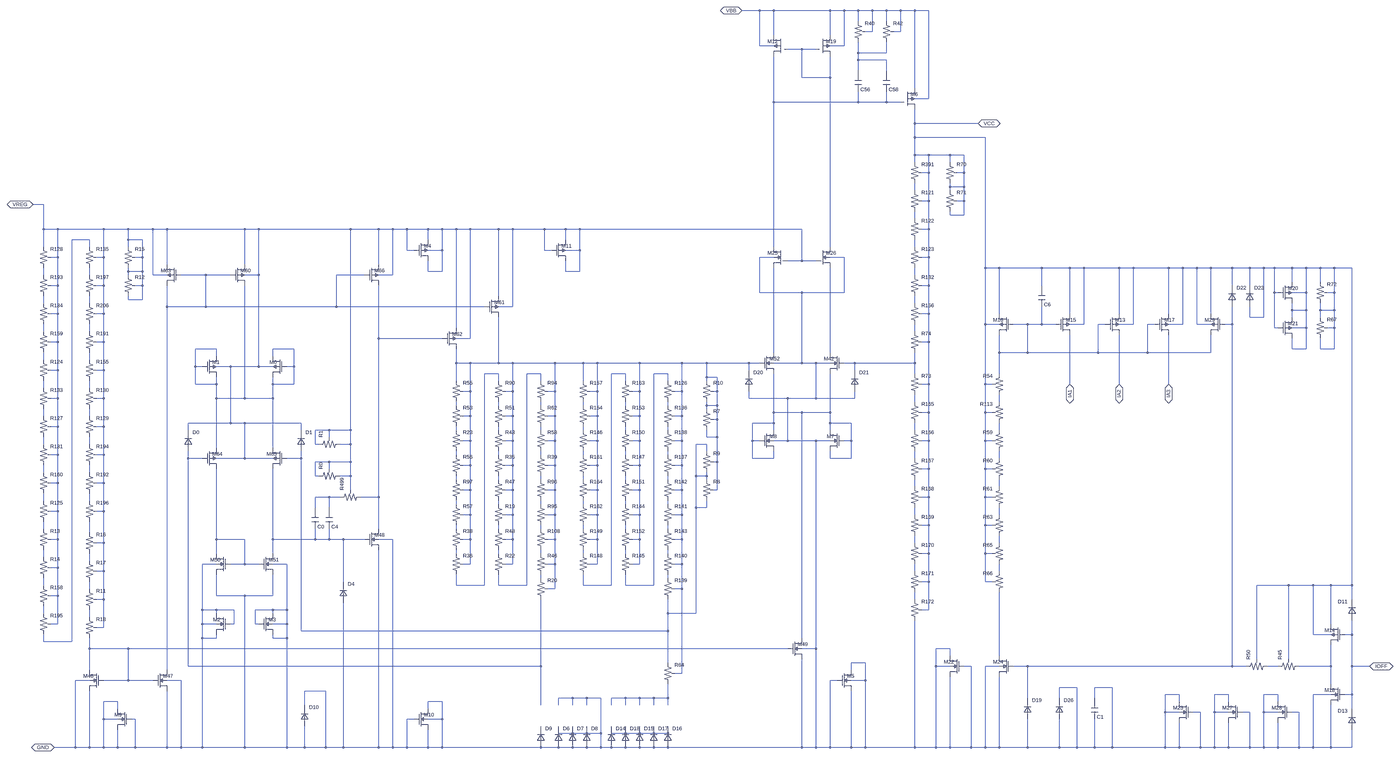
[diagram p0: schematic &400_VREG_00.asc, whole sheet]
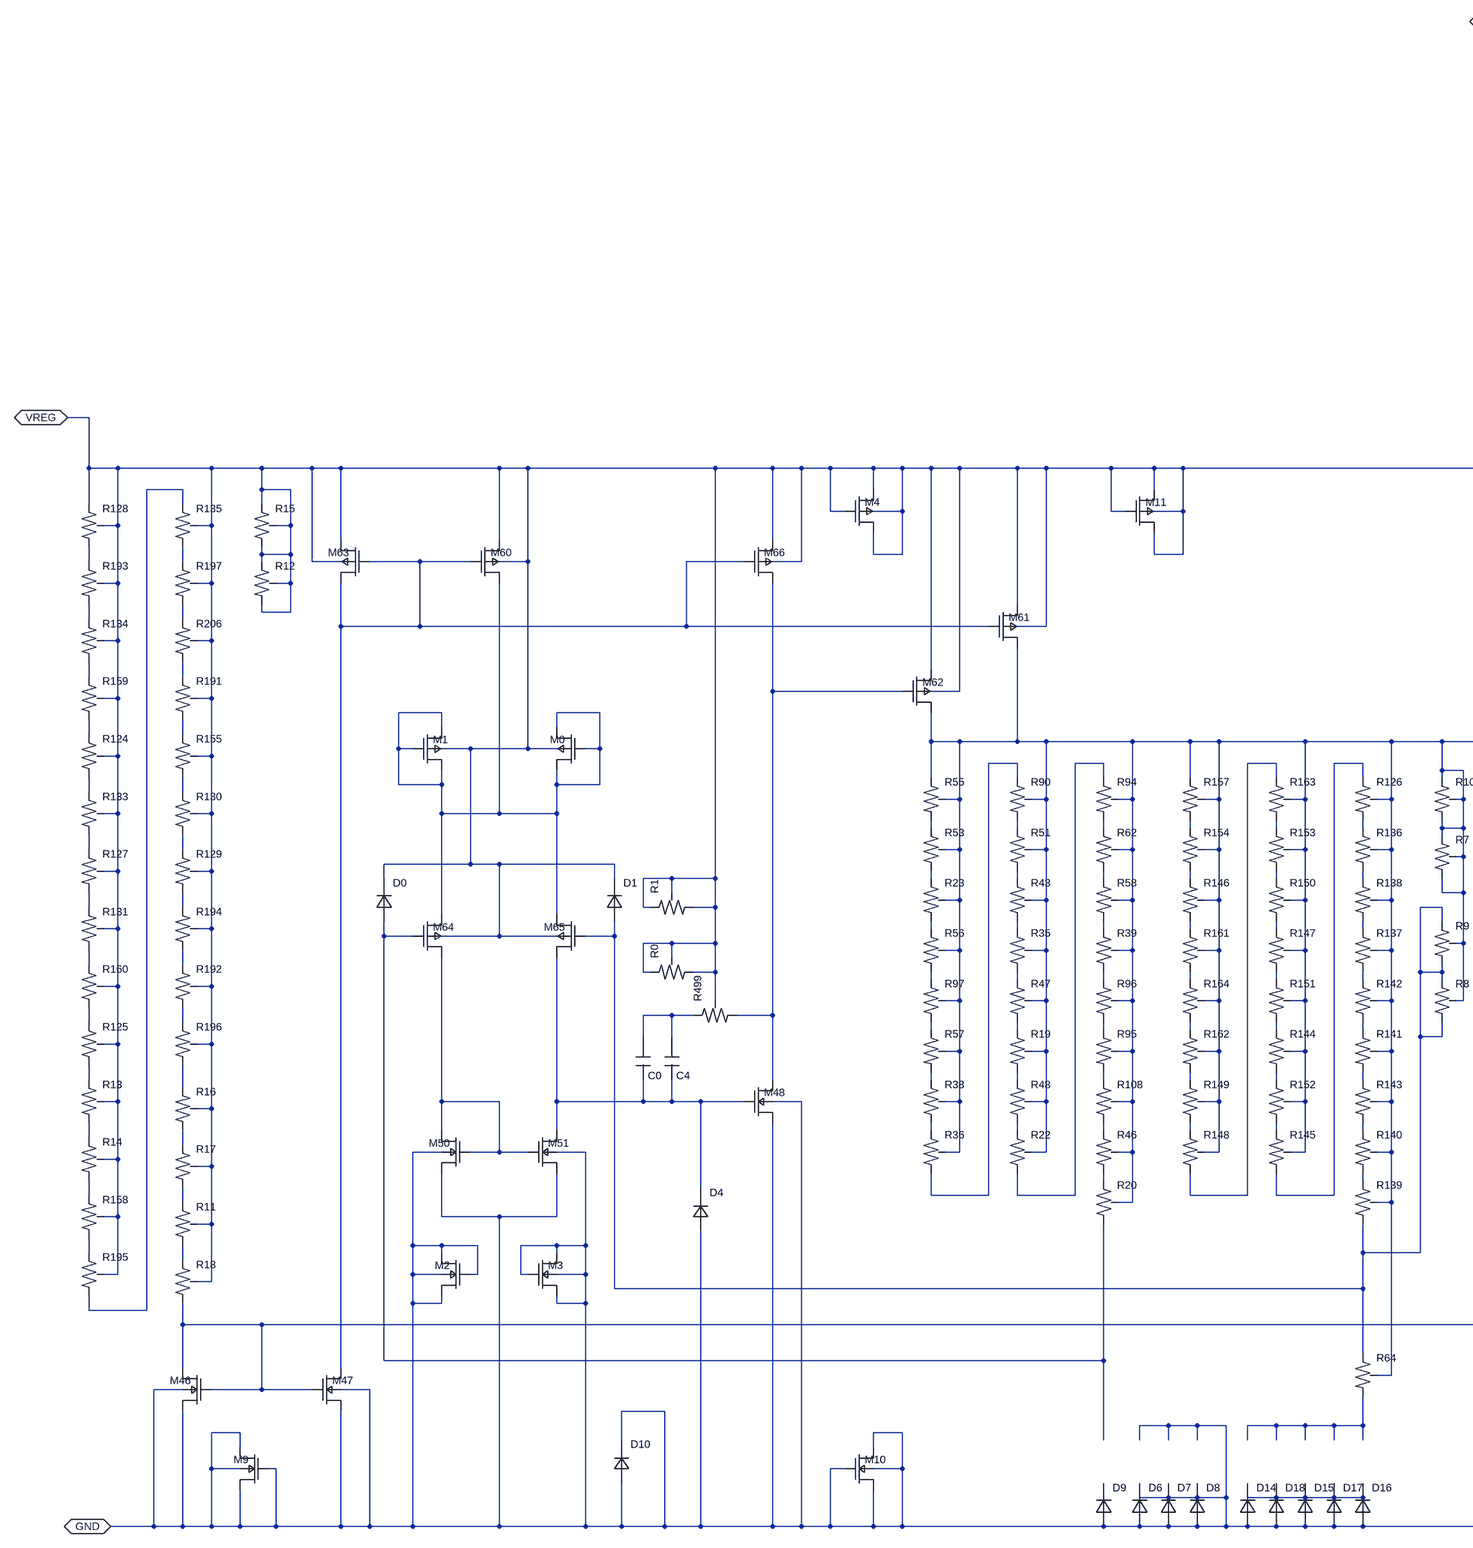
[diagram p1: schematic &400_VREG_00.asc, part, row 1 of 1, column 1 of 2]
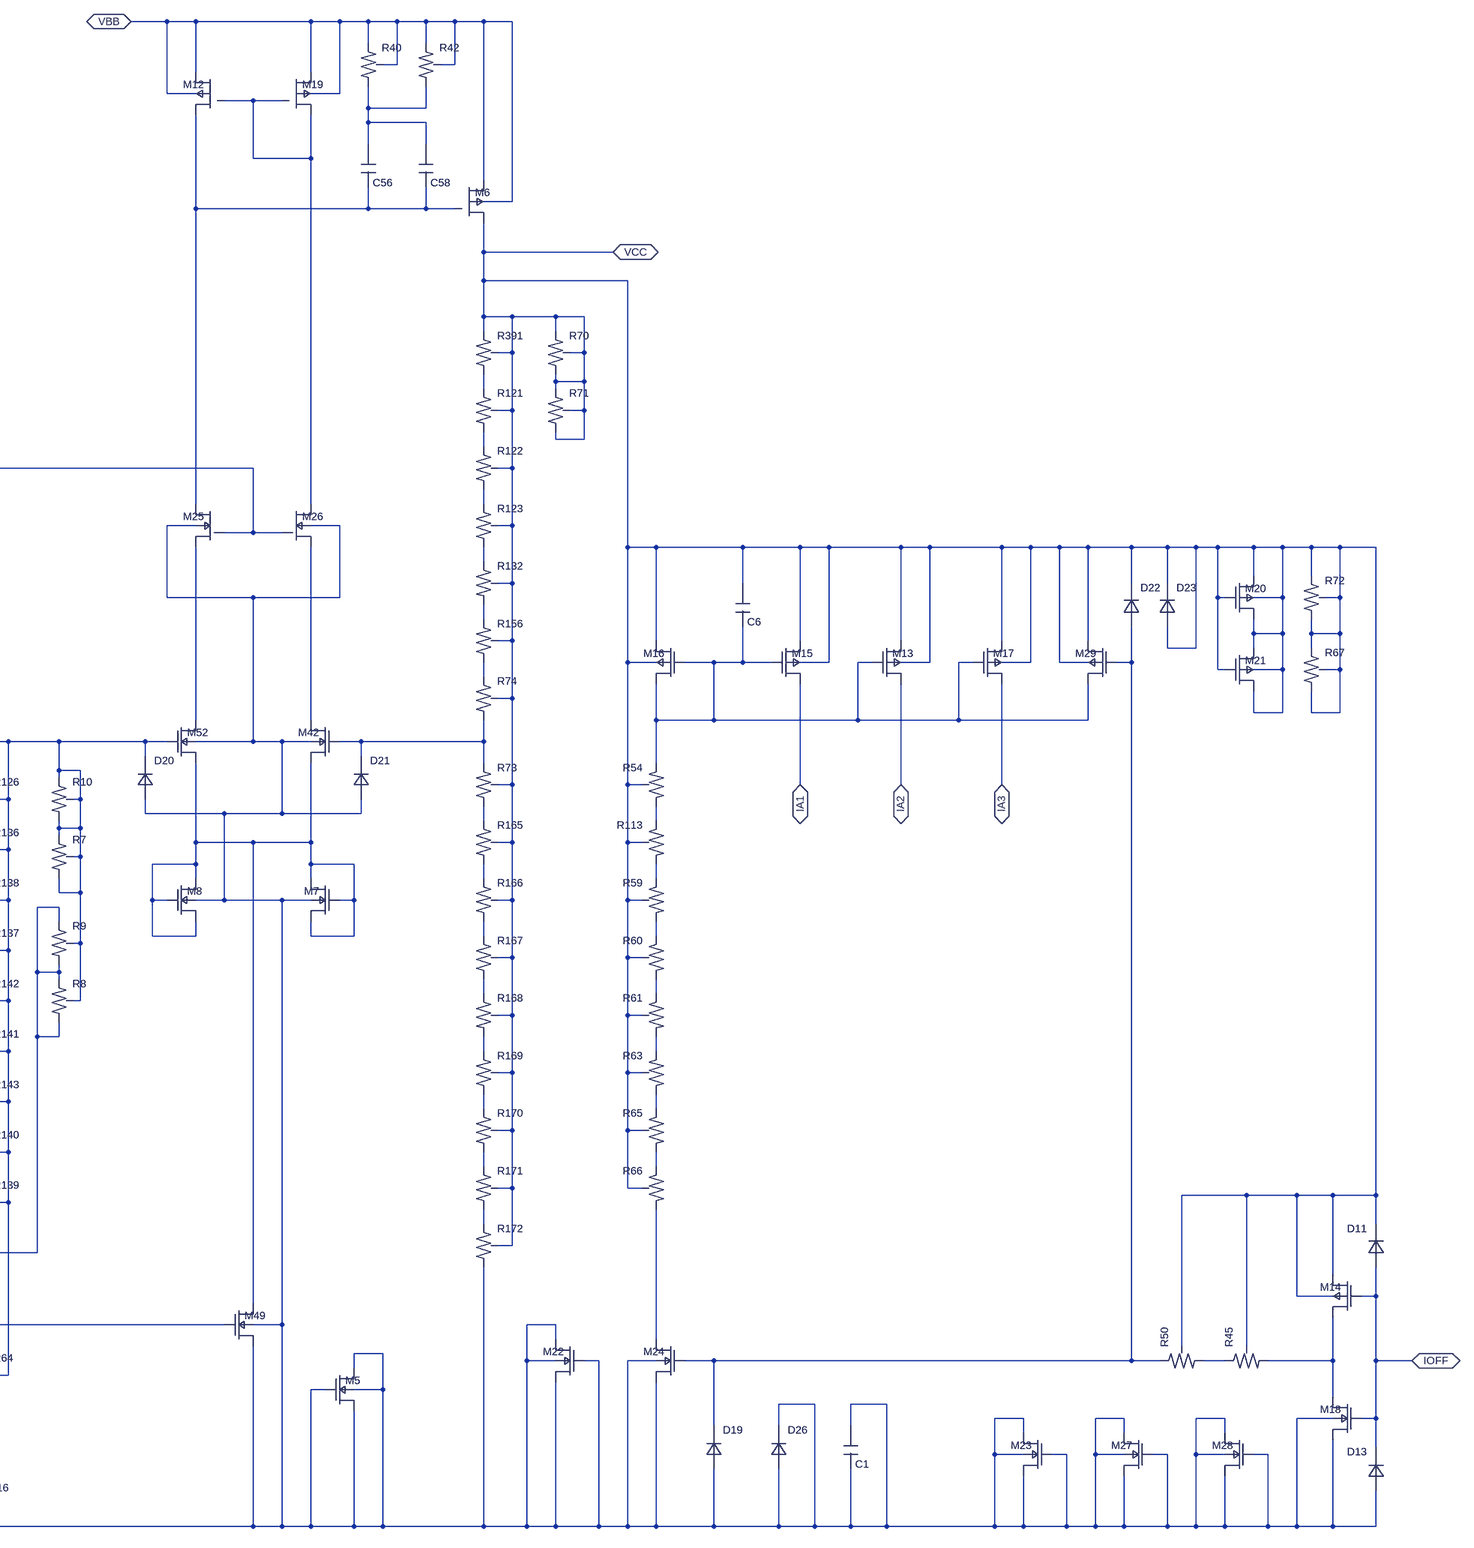
[diagram p2: schematic &400_VREG_00.asc, part, row 1 of 1, column 2 of 2]
&400_VREG_00.asc, the LTspice schematic file:
Version 4
SHEET 1 7088 2000
WIRE 3664 -704 3664 -928
WIRE 1008 -496 1008 -512
WIRE 2384 -2400 2448 -2400
WIRE 1872 -2400 2128 -2400
WIRE 2192 -2240 2192 -2400
WIRE 1808 -2240 1808 -2400
WIRE 2128 -2240 2192 -2240
WIRE 1808 -2240 1872 -2240
WIRE 1808 -2400 1872 -2400
WIRE 2256 -2352 2256 -2400
WIRE 2288 -2304 2320 -2304
WIRE 2384 -2352 2384 -2400
WIRE 1728 -2400 1808 -2400
WIRE 2576 -2000 2576 -2400
WIRE 2512 -2000 2576 -2000
WIRE 2416 -2304 2448 -2304
WIRE 2128 -2288 2128 -2400
WIRE 2448 -2400 2512 -2400
WIRE 1872 -2288 1872 -2400
WIRE 2128 -2400 2192 -2400
WIRE 2512 -2048 2512 -2400
WIRE 2256 -2400 2320 -2400
WIRE 2320 -2304 2320 -2400
WIRE 2512 -2400 2576 -2400
WIRE 2448 -2304 2448 -2400
WIRE 2320 -2400 2384 -2400
WIRE 2192 -2400 2256 -2400
WIRE 4496 704 4496 576
WIRE 4496 768 4496 704
WIRE 4496 432 4496 368
WIRE 4496 432 4464 432
WIRE 4496 704 4464 704
WIRE 4496 576 4496 432
WIRE 4496 576 4576 576
WIRE -1440 -560 -1440 -592
WIRE -1440 -48 -1440 -80
WIRE 1200 -48 1200 -64
WIRE 2512 -368 2512 -400
WIRE 432 -496 432 -512
WIRE 2896 -112 2896 -144
WIRE 1872 -576 2000 -576
WIRE 2224 -448 2224 -528
WIRE 2128 -528 2224 -528
WIRE 2224 -368 2224 -448
WIRE 1776 -448 1808 -448
WIRE 2128 -368 2224 -368
WIRE 1776 -528 1872 -528
WIRE 2128 -528 2128 -576
WIRE 1872 -528 1872 -576
WIRE 2192 -448 2224 -448
WIRE 2128 -368 2128 -400
WIRE 1872 -368 1872 -400
WIRE 1776 -448 1776 -528
WIRE 1872 -496 1872 -528
WIRE 2128 -496 2128 -528
WIRE 1872 -576 1872 -752
WIRE 2000 -576 2128 -576
WIRE 2128 -576 2128 -752
WIRE 1776 -368 1872 -368
WIRE 1776 -368 1776 -448
WIRE 2000 448 2000 -576
WIRE 624 -160 624 -176
WIRE 1392 64 1392 48
WIRE -1232 -304 -1232 -336
WIRE -144 -144 -144 -192
WIRE -144 -192 -96 -192
WIRE -208 -144 -208 -192
WIRE -208 -192 -144 -192
WIRE -1232 -176 -1232 -208
WIRE 1392 -608 1392 -624
WIRE 1200 -496 1200 -512
WIRE 816 64 816 48
WIRE 3568 -848 3568 -976
WIRE 2896 -848 3024 -848
WIRE 3024 -848 3024 -976
WIRE 3088 -976 3088 -1056
WIRE 3024 -848 3344 -848
WIRE 3344 -848 3568 -848
WIRE 3344 -976 3376 -976
WIRE 2896 -848 2896 -928
WIRE 2960 -976 3024 -976
WIRE 3568 -976 3600 -976
WIRE 2896 -752 2896 -848
WIRE 3568 -848 3856 -848
WIRE 3856 -848 3856 -928
WIRE 3088 -976 3152 -976
WIRE 3344 -848 3344 -976
WIRE 3024 -976 3088 -976
WIRE 2384 -1984 2384 -2032
WIRE 1872 -1984 1872 -2192
WIRE 2256 -1984 2256 -2032
WIRE 1872 -1328 1872 -1984
WIRE 2384 -1984 2448 -1984
WIRE 1872 -1984 2256 -1984
WIRE 2256 -1984 2384 -1984
WIRE -1440 -432 -1440 -464
WIRE 1200 -160 1200 -176
WIRE -1440 -1200 -1440 -1232
WIRE -1232 352 -1232 320
WIRE 1872 -848 1872 -1232
WIRE 2128 -848 2128 -1232
WIRE 4400 576 4400 480
WIRE 4256 576 4400 576
WIRE 4400 656 4400 576
WIRE 432 64 432 48
WIRE 2512 144 2512 112
WIRE 1392 -160 1392 -176
WIRE 2512 -1328 2512 -1360
WIRE -1232 -944 -1232 -976
WIRE -1440 -1072 -1440 -1104
WIRE 624 -496 624 -512
WIRE 1200 -272 1200 -288
WIRE -1056 640 -1056 496
WIRE -1168 640 -1056 640
WIRE -1056 640 -944 640
WIRE -1232 496 -1056 496
WIRE -1232 592 -1232 496
WIRE -1232 496 -1232 448
WIRE -1056 496 1936 496
WIRE 2512 -624 2512 -656
WIRE 2512 -1072 2512 -1104
WIRE -1232 224 -1232 192
WIRE 2512 -1200 2512 -1232
WIRE -1440 -176 -1440 -208
WIRE -784 -368 -784 -400
WIRE -784 -368 -720 -368
WIRE -784 576 -784 -368
WIRE 816 752 816 576
WIRE -784 576 816 576
WIRE 816 576 816 272
WIRE -144 0 -80 0
WIRE -144 0 -144 -48
WIRE -400 64 -400 0
WIRE -80 192 -80 0
WIRE -208 0 -208 -48
WIRE -208 0 -144 0
WIRE -400 0 -208 0
WIRE -80 0 16 0
WIRE -400 0 -400 -320
WIRE 1392 -272 1392 -288
WIRE 2512 16 2512 -16
WIRE -1232 -432 -1232 -464
WIRE 432 -608 432 -624
WIRE 1008 64 1008 48
WIRE 624 -384 624 -400
WIRE 816 -272 816 -288
WIRE 1008 -384 1008 -400
WIRE -1232 -560 -1232 -592
WIRE 624 -272 624 -288
WIRE 432 208 432 160
WIRE 432 208 560 208
WIRE 560 -752 624 -752
WIRE 624 -720 624 -752
WIRE 560 208 560 -752
WIRE 816 -496 816 -512
WIRE -1312 464 -1312 -1360
WIRE -1232 -1328 -1232 -1360
WIRE -1312 -1360 -1232 -1360
WIRE -1440 464 -1312 464
WIRE -1440 464 -1440 432
WIRE 1392 176 1392 160
WIRE 3216 -704 3216 -928
WIRE 3440 -704 3440 -928
WIRE 2512 -1824 2832 -1824
WIRE 2512 -1888 2512 -1952
WIRE 2576 -1280 2576 -1408
WIRE 2672 -1600 2736 -1600
WIRE 2544 -576 2576 -576
WIRE 2576 -64 2576 -192
WIRE 2544 320 2576 320
WIRE 2576 320 2576 192
WIRE 2576 -320 2576 -448
WIRE 2544 64 2576 64
WIRE 3728 -976 3728 -1232
WIRE 4416 -1232 4496 -1232
WIRE 2576 -192 2576 -320
WIRE 2576 192 2576 64
WIRE 2544 -1408 2576 -1408
WIRE 2544 -1664 2576 -1664
WIRE 2896 -1024 2896 -1232
WIRE 2544 192 2576 192
WIRE 2512 -1888 2800 -1888
WIRE 2672 -1712 2672 -1744
WIRE 2512 -1824 2512 -1888
WIRE 2544 -448 2576 -448
WIRE 2704 -1536 2736 -1536
WIRE 4224 -960 4288 -960
WIRE 4224 -864 4224 -912
WIRE 2512 -1712 2512 -1744
WIRE 2576 -1024 2576 -1152
WIRE 4224 -1232 4288 -1232
WIRE 3088 -1232 3216 -1232
WIRE 2672 -1472 2736 -1472
WIRE 2672 -1584 2672 -1600
WIRE 2736 -1472 2736 -1536
WIRE 2512 -1744 2512 -1824
WIRE 2544 -1152 2576 -1152
WIRE 2544 -1280 2576 -1280
WIRE 2672 -1744 2736 -1744
WIRE 2576 -1408 2576 -1536
WIRE 2736 -1664 2736 -1744
WIRE 2544 -64 2576 -64
WIRE 2576 -448 2576 -576
WIRE 2544 -192 2576 -192
WIRE 2544 -320 2576 -320
WIRE 2576 64 2576 -64
WIRE 2544 -1024 2576 -1024
WIRE 2544 -1536 2576 -1536
WIRE 2576 -1536 2576 -1664
WIRE 4352 -1040 4352 -1072
WIRE 2576 -1152 2576 -1280
WIRE 2576 -1664 2576 -1744
WIRE 2832 -976 2896 -976
WIRE 4400 384 4400 208
WIRE 4400 208 4496 208
WIRE 3280 -1232 3440 -1232
WIRE 4320 432 4400 432
WIRE 4496 272 4496 208
WIRE 2512 -1744 2576 -1744
WIRE 4496 208 4496 -1232
WIRE 4288 -1120 4288 -1232
WIRE 4032 -1008 4096 -1008
WIRE 4320 432 4320 208
WIRE 3728 -1232 3792 -1232
WIRE 2832 -976 2832 -1232
WIRE 3216 -1024 3216 -1232
WIRE 4096 -1008 4096 -1232
WIRE 4320 208 4400 208
WIRE 3216 -1232 3280 -1232
WIRE 3216 -976 3280 -976
WIRE 3664 -976 3728 -976
WIRE 3792 -976 3792 -1232
WIRE 3280 -976 3280 -1232
WIRE 3952 -1152 3952 -1232
WIRE 3792 -1232 3856 -1232
WIRE 4224 -1120 4288 -1120
WIRE 2896 -1232 3088 -1232
WIRE 3664 -1024 3664 -1232
WIRE 3792 -976 3856 -976
WIRE 4288 -864 4288 -960
WIRE 3440 -976 3504 -976
WIRE 2832 -704 2832 -976
WIRE 2832 -1232 2896 -1232
WIRE 2544 -704 2576 -704
WIRE 2832 -576 2864 -576
WIRE 2832 -576 2832 -704
WIRE 2832 -448 2864 -448
WIRE 2832 -320 2864 -320
WIRE 3664 -1232 3728 -1232
WIRE 2832 -704 2864 -704
WIRE 2832 -448 2832 -576
WIRE 2832 -320 2832 -448
WIRE 2832 192 2832 64
WIRE 2832 64 2832 -64
WIRE 4064 544 4064 208
WIRE 2832 192 2864 192
WIRE 4064 208 4208 208
WIRE 2832 -64 2864 -64
WIRE 2736 -1536 2736 -1600
WIRE 2832 64 2864 64
WIRE 2576 -704 2576 -896
WIRE 3952 -1232 4032 -1232
WIRE 4208 544 4208 208
WIRE 2832 -1232 2832 -1824
WIRE 2832 -192 2832 -320
WIRE 4208 208 4320 208
WIRE 2832 -192 2864 -192
WIRE 2832 -64 2832 -192
WIRE 3856 -1024 3856 -1232
WIRE 4144 -960 4144 -1120
WIRE 4288 -960 4288 -1040
WIRE 2672 -1472 2672 -1488
WIRE 2736 -1600 2736 -1664
WIRE 2672 -1600 2672 -1616
WIRE 2704 -1664 2736 -1664
WIRE 4144 -960 4160 -960
WIRE 4416 -1120 4416 -1232
WIRE 3856 -1232 3952 -1232
WIRE 4352 -864 4416 -864
WIRE 4416 -864 4416 -960
WIRE 4352 -1232 4416 -1232
WIRE 4416 -960 4416 -1040
WIRE 4352 -1168 4352 -1232
WIRE 4384 -960 4416 -960
WIRE 4416 -1040 4416 -1120
WIRE 4032 -1152 4032 -1232
WIRE 4032 -1008 4032 -1056
WIRE 3440 -1024 3440 -1232
WIRE 3504 -976 3504 -1232
WIRE 3440 -1232 3504 -1232
WIRE 4096 -1232 4144 -1232
WIRE 4032 -1232 4096 -1232
WIRE 3504 -1232 3664 -1232
WIRE 4352 -1040 4416 -1040
WIRE 4352 -864 4352 -912
WIRE 4384 -1120 4416 -1120
WIRE 4352 -1008 4352 -1040
WIRE 2576 -576 2576 -704
WIRE 4288 -1232 4352 -1232
WIRE 4224 -1040 4224 -1072
WIRE 4224 -1008 4224 -1040
WIRE 4224 -864 4288 -864
WIRE 4288 -1040 4288 -1120
WIRE 3088 -1152 3088 -1232
WIRE 4224 -1168 4224 -1232
WIRE 4224 -1040 4288 -1040
WIRE 4144 -1120 4144 -1232
WIRE 4144 -1232 4224 -1232
WIRE 4144 -1120 4160 -1120
WIRE 2576 -1744 2672 -1744
WIRE 2544 -896 2576 -896
WIRE 2576 -896 2576 -1024
WIRE 2512 -944 2512 -976
WIRE -1408 -640 -1376 -640
WIRE -48 -1408 80 -1408
WIRE -1488 -1520 -1440 -1520
WIRE -1408 -128 -1376 -128
WIRE -1376 0 -1376 -128
WIRE -1376 -128 -1376 -256
WIRE -1376 -768 -1376 -896
WIRE -1376 -640 -1376 -768
WIRE -1408 -896 -1376 -896
WIRE -1408 -768 -1376 -768
WIRE -1376 -256 -1376 -384
WIRE -1408 -256 -1376 -256
WIRE -1376 -512 -1376 -640
WIRE -1408 -384 -1376 -384
WIRE -1440 -1408 -1440 -1520
WIRE -48 -496 -48 -1408
WIRE -1376 -384 -1376 -512
WIRE -1408 0 -1376 0
WIRE -944 -1408 -880 -1408
WIRE -592 -528 -528 -528
WIRE -944 -1200 -944 -1408
WIRE -1408 256 -1376 256
WIRE -1408 128 -1376 128
WIRE -528 -528 -272 -528
WIRE -656 -784 -592 -784
WIRE -1376 256 -1376 128
WIRE -1408 -512 -1376 -512
WIRE -992 -1152 -992 -1216
WIRE -592 -528 -592 -784
WIRE -1200 -128 -1168 -128
WIRE -1200 -256 -1168 -256
WIRE 992 -1216 992 -1312
WIRE -272 -496 -272 -528
WIRE -1056 -1216 -1056 -1232
WIRE 368 -1312 368 -1408
WIRE -880 -1408 -528 -1408
WIRE -592 -784 -464 -784
WIRE -1376 -1408 -1168 -1408
WIRE 928 -1216 992 -1216
WIRE -1376 128 -1376 0
WIRE 144 -1408 208 -1408
WIRE 624 -1056 688 -1056
WIRE 496 -912 496 -1408
WIRE 80 -1248 80 -1408
WIRE -1200 -1280 -1168 -1280
WIRE -656 -368 -528 -368
WIRE 432 -960 432 -1408
WIRE -464 -784 -464 -1200
WIRE -1168 -256 -1168 -384
WIRE 688 -1056 688 -1408
WIRE 80 -1200 144 -1200
WIRE 80 -1408 144 -1408
WIRE 144 -1200 144 -1408
WIRE -880 -1248 -880 -1408
WIRE 2000 -1264 2064 -1264
WIRE 1936 -1264 2000 -1264
WIRE -208 -432 -208 -496
WIRE -208 -432 -192 -432
WIRE -1200 -384 -1168 -384
WIRE 624 -1104 624 -1408
WIRE -528 -368 -528 -528
WIRE 432 -912 496 -912
WIRE -464 -784 -400 -784
WIRE -144 -320 -144 -352
WIRE -144 -352 -48 -352
WIRE 432 -1408 496 -1408
WIRE -208 -352 -144 -352
WIRE -48 -352 -48 -432
WIRE -208 -288 -208 -352
WIRE -208 -288 -192 -288
WIRE -96 -288 -48 -288
WIRE -48 -288 -48 -352
WIRE -96 -432 -48 -432
WIRE -48 -432 -48 -496
WIRE -144 -496 -48 -496
WIRE -144 -464 -144 -496
WIRE -208 -496 -144 -496
WIRE -1168 -384 -1168 -512
WIRE -1168 -896 -1168 -1024
WIRE -1168 -1024 -1168 -1152
WIRE -1200 -1152 -1168 -1152
WIRE -1200 -1024 -1168 -1024
WIRE -1168 -640 -1168 -768
WIRE -1168 -512 -1168 -640
WIRE -1200 -640 -1168 -640
WIRE -1200 -512 -1168 -512
WIRE -1200 -896 -1168 -896
WIRE -1200 -768 -1168 -768
WIRE -1168 -768 -1168 -896
WIRE -528 -368 -400 -368
WIRE -528 -1248 -528 -1408
WIRE -1056 -1360 -992 -1360
WIRE -1408 -1280 -1376 -1280
WIRE -1376 -1152 -1376 -1280
WIRE -1408 -1024 -1376 -1024
WIRE -1408 -1152 -1376 -1152
WIRE -1200 400 -1168 400
WIRE -1168 -1152 -1168 -1280
WIRE -1376 -1024 -1376 -1152
WIRE -1376 -896 -1376 -1024
WIRE -1168 -1408 -1056 -1408
WIRE -464 -1200 -464 -1408
WIRE -784 -496 -784 -528
WIRE -1440 -1328 -1440 -1408
WIRE -784 -528 -592 -528
WIRE -48 -224 -48 -288
WIRE -1168 -1280 -1168 -1408
WIRE -1376 -1280 -1376 -1408
WIRE -1440 -1408 -1376 -1408
WIRE -1056 -1216 -992 -1216
WIRE -1376 384 -1376 256
WIRE -528 -1408 -464 -1408
WIRE -944 -1200 -880 -1200
WIRE -528 -1200 -464 -1200
WIRE -1056 -1088 -1056 -1104
WIRE 928 -1216 928 -1264
WIRE -992 -1280 -992 -1360
WIRE -1024 -1152 -992 -1152
WIRE -1408 384 -1376 384
WIRE -1168 400 -1168 272
WIRE -1056 -1328 -1056 -1360
WIRE 832 -1312 832 -1408
WIRE -1168 -128 -1168 -256
WIRE 832 -1312 864 -1312
WIRE 992 -1312 992 -1408
WIRE 304 -1216 304 -1264
WIRE 304 -1408 368 -1408
WIRE -1024 -1280 -992 -1280
WIRE -1200 272 -1168 272
WIRE -1168 272 -1168 144
WIRE -1056 -1200 -1056 -1216
WIRE -1168 16 -1168 -128
WIRE -992 -1216 -992 -1280
WIRE 832 -1408 928 -1408
WIRE 2000 -1264 2000 -1408
WIRE -1056 -1408 -944 -1408
WIRE -1168 144 -1168 16
WIRE 368 -1216 368 -1312
WIRE 368 -1408 432 -1408
WIRE 624 -1408 688 -1408
WIRE 928 -1360 928 -1408
WIRE -1056 -1360 -1056 -1408
WIRE 992 -1408 2000 -1408
WIRE -1200 16 -1168 16
WIRE -1200 144 -1168 144
WIRE 304 -1360 304 -1408
WIRE 928 -1312 992 -1312
WIRE -992 -1088 -992 -1152
WIRE 496 -1408 624 -1408
WIRE 304 -1312 368 -1312
WIRE 208 -1312 208 -1408
WIRE 304 -1216 368 -1216
WIRE 208 -1408 304 -1408
WIRE 208 -1312 240 -1312
WIRE -1056 -1088 -992 -1088
WIRE 928 -1408 992 -1408
WIRE -464 -1408 -48 -1408
WIRE 688 -1408 832 -1408
WIRE 3328 944 3328 816
WIRE 2768 944 2768 576
WIRE 2608 944 2608 576
WIRE 208 944 304 944
WIRE 1200 880 1200 848
WIRE -400 384 -336 384
WIRE -720 944 -528 944
WIRE 2000 944 2000 544
WIRE -80 944 -80 288
WIRE -336 448 -336 384
WIRE -720 320 -656 320
WIRE 1088 880 1088 720
WIRE 2288 944 2512 944
WIRE -656 320 -576 320
WIRE -576 384 -576 320
WIRE -400 448 -336 448
WIRE -592 384 -576 384
WIRE -720 320 -720 112
WIRE -336 384 -336 320
WIRE -720 944 -720 448
WIRE 80 0 144 0
WIRE -656 448 -656 432
WIRE -720 384 -720 320
WIRE -480 384 -480 320
WIRE -656 336 -656 320
WIRE -480 320 -400 320
WIRE -720 384 -656 384
WIRE -400 320 -336 320
WIRE -400 336 -400 320
WIRE 2064 -640 2064 -800
WIRE 1264 880 1264 848
WIRE 1264 880 1328 880
WIRE 1328 880 1328 848
WIRE 816 944 816 848
WIRE 80 944 144 944
WIRE 80 944 80 48
WIRE -1296 640 -1232 640
WIRE -816 944 -720 944
WIRE -720 448 -656 448
WIRE -480 384 -464 384
WIRE -400 448 -400 432
WIRE 3936 944 3936 832
WIRE -336 944 -336 448
WIRE -1232 944 -1232 688
WIRE -1296 944 -1296 640
WIRE 304 944 368 944
WIRE 1136 880 1200 880
WIRE 2064 944 2064 496
WIRE 1136 880 1136 848
WIRE 1200 880 1264 880
WIRE -336 320 -336 112
WIRE 2000 496 2064 496
WIRE 2000 944 2064 944
WIRE -720 448 -720 384
WIRE -656 256 -528 256
WIRE 2224 592 2224 560
WIRE -656 256 -656 160
WIRE -720 112 -656 112
WIRE -528 944 -528 256
WIRE -400 112 -336 112
WIRE -880 640 -816 640
WIRE -880 944 -880 688
WIRE 2224 560 2288 560
WIRE -1168 944 -1104 944
WIRE -816 944 -816 640
WIRE 1088 944 1088 880
WIRE -880 944 -816 944
WIRE 3024 944 3168 944
WIRE 1392 880 1392 848
WIRE 1392 944 1392 880
WIRE -400 256 -400 160
WIRE -80 944 80 944
WIRE 1024 880 1024 848
WIRE 2192 -1120 2192 -1280
WIRE -528 256 -400 256
WIRE 1872 -448 1936 -448
WIRE 896 880 960 880
WIRE 1936 -640 2064 -640
WIRE 208 816 240 816
WIRE 1936 -448 2064 -448
WIRE -1168 816 -1168 736
WIRE 1760 -640 1760 -672
WIRE -1104 944 -1024 944
WIRE 1808 -1120 2000 -1120
WIRE 2064 496 2064 -448
WIRE 208 944 208 816
WIRE -1040 816 -1024 816
WIRE -1392 944 -1296 944
WIRE 3648 944 3648 784
WIRE 2768 944 2832 944
WIRE -160 944 -80 944
WIRE 1328 880 1392 880
WIRE -1296 944 -1232 944
WIRE 1872 -800 2000 -800
WIRE 816 944 1088 944
WIRE -1168 944 -1168 816
WIRE 4096 704 4160 704
WIRE 960 880 1024 880
WIRE 3328 672 3408 672
WIRE 2064 -800 2128 -800
WIRE 960 880 960 848
WIRE 2128 -1280 2192 -1280
WIRE 960 752 960 720
WIRE 2064 944 2128 944
WIRE -336 944 -256 944
WIRE 1024 880 1088 880
WIRE 304 736 368 736
WIRE 304 816 368 816
WIRE 1088 944 1392 944
WIRE 2064 -640 2240 -640
WIRE 2672 944 2672 624
WIRE -1024 944 -1024 816
WIRE -1104 768 -1104 736
WIRE 2064 -448 2128 -448
WIRE 3808 944 3872 944
WIRE 2000 -800 2000 -1120
WIRE 2608 944 2672 944
WIRE 3408 944 3408 672
WIRE 1808 -1120 1808 -1280
WIRE 1808 -1280 1872 -1280
WIRE 3648 944 3712 944
WIRE 144 944 144 0
WIRE 3872 944 3872 784
WIRE 1936 -448 1936 -640
WIRE 368 816 368 736
WIRE 2832 944 2832 576
WIRE 2832 576 2896 576
WIRE 3168 944 3248 944
WIRE 4496 944 4496 864
WIRE 4400 944 4400 752
WIRE -256 944 -256 848
WIRE 4320 944 4400 944
WIRE 4096 784 4096 704
WIRE 4400 944 4496 944
WIRE 3328 944 3408 944
WIRE -1104 944 -1104 864
WIRE 2832 944 2896 944
WIRE 2224 944 2288 944
WIRE 2128 944 2128 640
WIRE 4096 944 4096 784
WIRE 304 944 304 864
WIRE 2224 944 2224 688
WIRE 2128 640 2160 640
WIRE 2288 640 2288 560
WIRE 896 880 896 848
WIRE 3712 944 3808 944
WIRE 2128 944 2224 944
WIRE 2000 -800 2064 -800
WIRE 896 720 960 720
WIRE 4320 704 4400 704
WIRE -1024 944 -880 944
WIRE 3712 944 3712 832
WIRE 2224 640 2288 640
WIRE 3168 944 3168 816
WIRE 4320 944 4320 704
WIRE -256 752 -256 688
WIRE 2288 944 2288 640
WIRE -256 688 -160 688
WIRE 2896 944 2896 624
WIRE 2000 -1120 2192 -1120
WIRE 1024 720 1088 720
WIRE 896 752 896 720
WIRE 3648 784 3712 784
WIRE -1232 944 -1168 944
WIRE 304 768 304 736
WIRE -1168 816 -1104 816
WIRE 2512 944 2512 368
WIRE 368 944 368 816
WIRE 1392 944 2000 944
WIRE -528 944 -336 944
WIRE 2240 -640 2240 -672
WIRE 2896 944 3024 944
WIRE 1024 752 1024 720
WIRE 960 720 1024 720
WIRE 2512 944 2608 944
WIRE -256 944 -160 944
WIRE -160 944 -160 688
WIRE -1168 736 -1104 736
WIRE 3168 720 3168 672
WIRE 3712 736 3712 704
WIRE 2608 576 2672 576
WIRE 4160 944 4160 832
WIRE 4096 784 4160 784
WIRE 4160 944 4256 944
WIRE 1760 -640 1936 -640
WIRE 2608 496 2672 496
WIRE 3776 784 3808 784
WIRE 2608 576 2608 496
WIRE 4160 736 4160 704
WIRE 3936 944 4032 944
WIRE 4256 944 4256 784
WIRE 2736 576 2768 576
WIRE 3648 784 3648 704
WIRE 2672 528 2672 496
WIRE 4224 784 4256 784
WIRE 4032 944 4032 784
WIRE 3648 704 3712 704
WIRE 3328 720 3328 672
WIRE 4256 944 4320 944
WIRE 3024 944 3024 816
WIRE 4096 944 4160 944
WIRE 3872 944 3936 944
WIRE 2672 944 2768 944
WIRE 3408 944 3648 944
WIRE 3248 944 3248 672
WIRE 3808 944 3808 784
WIRE 3168 672 3248 672
WIRE 3872 784 3936 784
WIRE 3872 704 3936 704
WIRE 3936 736 3936 704
WIRE 144 944 208 944
WIRE 3248 944 3328 944
WIRE 4032 944 4096 944
WIRE 4000 784 4032 784
WIRE 3872 784 3872 704
WIRE 368 944 816 944
WIRE 1008 -272 1008 -288
WIRE 816 -160 816 -176
WIRE -1232 96 -1232 64
WIRE 1392 -48 1392 -64
WIRE 1008 -160 1008 -176
WIRE 1200 -384 1200 -400
WIRE 1008 208 1136 208
WIRE 1008 208 1008 160
WIRE 1136 208 1136 -752
WIRE 1136 -752 1200 -752
WIRE 1200 -720 1200 -752
WIRE -1232 -688 -1232 -720
WIRE 1520 -432 1568 -432
WIRE -272 416 -272 -368
WIRE 1568 -272 1568 -288
WIRE -336 -368 -272 -368
WIRE -272 -368 -272 -400
WIRE 1568 -288 1568 -304
WIRE 1520 336 1520 -144
WIRE 1392 336 1520 336
WIRE 1520 -288 1520 -432
WIRE 1392 336 1392 272
WIRE 1520 -144 1568 -144
WIRE 1520 -144 1520 -288
WIRE 1520 -288 1568 -288
WIRE 1568 -144 1568 -176
WIRE 1568 -400 1568 -432
WIRE 1392 560 1392 416
WIRE -272 416 1392 416
WIRE 1392 416 1392 336
WIRE 1200 -608 1200 -624
WIRE 816 -608 816 -624
WIRE 2960 576 3024 576
WIRE 3952 576 3952 -976
WIRE 3952 -976 3952 -1056
WIRE 3952 576 4016 576
WIRE 3024 576 3952 576
WIRE 3024 720 3024 576
WIRE 3920 -976 3952 -976
WIRE -1440 336 -1440 304
WIRE -1440 208 -1440 176
WIRE 2512 272 2512 240
WIRE -1440 80 -1440 48
WIRE 2000 -2224 2064 -2224
WIRE 2000 -2096 2128 -2096
WIRE 1936 -2224 2000 -2224
WIRE 2128 -1328 2128 -2096
WIRE 2128 -2096 2128 -2192
WIRE 2000 -2096 2000 -2224
WIRE -656 -640 -656 -704
WIRE -400 -864 -304 -864
WIRE -528 -640 -400 -640
WIRE -400 -416 -400 -640
WIRE -752 -704 -752 -784
WIRE -752 -784 -752 -864
WIRE -752 -864 -656 -864
WIRE -656 -416 -656 -640
WIRE -752 -704 -656 -704
WIRE -400 -704 -304 -704
WIRE -400 -704 -400 -736
WIRE -528 -640 -528 -1152
WIRE -656 -704 -656 -736
WIRE -400 -832 -400 -864
WIRE -752 -784 -720 -784
WIRE -304 -784 -304 -864
WIRE -656 -832 -656 -864
WIRE -336 -784 -304 -784
WIRE -304 -704 -304 -784
WIRE -656 -640 -528 -640
WIRE -400 -640 -400 -704
WIRE 2896 -624 2896 -656
WIRE 816 176 816 160
WIRE 2896 -240 2896 -272
WIRE 2896 16 2896 -16
WIRE 2896 -368 2896 -400
WIRE 2256 -2128 2256 -2176
WIRE 2256 -2208 2256 -2256
WIRE 2384 -2208 2384 -2256
WIRE 2384 -2128 2384 -2176
WIRE 2256 -2176 2384 -2176
WIRE 2256 -2208 2384 -2208
WIRE 2256 -2176 2256 -2208
WIRE 2512 -800 2512 -848
WIRE 2240 -800 2512 -800
WIRE 2240 -768 2240 -800
WIRE 2192 -800 2240 -800
WIRE 2512 -752 2512 -800
WIRE -1232 -816 -1232 -848
WIRE -1440 -944 -1440 -976
WIRE 624 -608 624 -624
WIRE 432 -160 432 -176
WIRE 2512 -240 2512 -272
WIRE 2896 528 2896 240
WIRE 2512 -496 2512 -528
WIRE 2512 -1584 2512 -1616
WIRE 432 -384 432 -400
WIRE 816 -48 816 -64
WIRE 1008 -608 1008 -624
WIRE 4112 576 4160 576
WIRE 1200 208 1200 160
WIRE 1200 208 1328 208
WIRE 1392 -720 1392 -752
WIRE 1328 208 1328 -752
WIRE 1328 -752 1392 -752
WIRE 2896 -496 2896 -528
WIRE 2896 144 2896 112
WIRE 2512 -112 2512 -144
WIRE 2512 -1456 2512 -1488
WIRE -1440 -304 -1440 -336
WIRE 1392 -384 1392 -400
WIRE 624 64 624 48
WIRE 624 -48 624 -64
WIRE -1232 -1072 -1232 -1104
WIRE -656 64 -656 0
WIRE -528 112 -528 0
WIRE -528 112 -464 112
WIRE -592 112 -528 112
WIRE -656 0 -656 -320
WIRE -656 0 -528 0
WIRE -880 592 -880 -1056
WIRE -880 -1056 -704 -1056
WIRE -112 -1056 -112 -1200
WIRE -880 -1056 -880 -1152
WIRE -816 -1200 -704 -1200
WIRE -704 -1056 -704 -1200
WIRE -704 -1200 -592 -1200
WIRE -704 -1056 -112 -1056
WIRE -112 -1056 560 -1056
WIRE -112 -1200 16 -1200
WIRE 1456 608 1456 224
WIRE 496 -800 624 -800
WIRE 656 -560 688 -560
WIRE 464 -560 496 -560
WIRE 496 -672 496 -800
WIRE 496 -560 496 -672
WIRE 688 -560 688 -672
WIRE 848 -336 880 -336
WIRE 688 -672 688 -800
WIRE 880 -800 1008 -800
WIRE 1264 -560 1264 -672
WIRE 432 -800 496 -800
WIRE 1264 -448 1264 -560
WIRE 1072 -448 1072 -560
WIRE 880 -560 880 -672
WIRE 848 -560 880 -560
WIRE 880 -448 880 -560
WIRE 848 -448 880 -448
WIRE 880 -336 880 -448
WIRE 1072 -224 1072 -336
WIRE 1264 -224 1264 -336
WIRE 1568 -800 1760 -800
WIRE 464 0 496 0
WIRE 1232 0 1264 0
WIRE 848 -112 880 -112
WIRE 1008 -720 1008 -800
WIRE 848 0 880 0
WIRE 880 0 880 -112
WIRE 688 -448 688 -560
WIRE 496 -448 496 -560
WIRE 464 112 496 112
WIRE 656 112 688 112
WIRE 1232 112 1264 112
WIRE 880 224 880 112
WIRE 848 224 880 224
WIRE 848 112 880 112
WIRE 1568 -736 1568 -800
WIRE 848 -672 880 -672
WIRE 688 -336 688 -448
WIRE 1072 0 1072 -112
WIRE 496 -336 496 -448
WIRE 1008 -800 1072 -800
WIRE 880 -672 880 -800
WIRE 880 -224 880 -336
WIRE 1232 -224 1264 -224
WIRE 1040 -112 1072 -112
WIRE 1072 -800 1264 -800
WIRE 688 -800 880 -800
WIRE 1264 0 1264 -112
WIRE 1040 0 1072 0
WIRE 1040 -224 1072 -224
WIRE 432 -800 432 -864
WIRE 464 -336 496 -336
WIRE 496 -224 496 -336
WIRE 688 -224 688 -336
WIRE 464 -112 496 -112
WIRE 656 -224 688 -224
WIRE 1072 -672 1072 -800
WIRE 656 -336 688 -336
WIRE 464 -224 496 -224
WIRE 1232 -672 1264 -672
WIRE 1040 -672 1072 -672
WIRE 1040 -336 1072 -336
WIRE 1232 -560 1264 -560
WIRE 496 0 496 -112
WIRE 1040 -560 1072 -560
WIRE 656 -672 688 -672
WIRE 464 -672 496 -672
WIRE 848 -224 880 -224
WIRE 1040 -448 1072 -448
WIRE 1232 -448 1264 -448
WIRE 1616 -352 1616 -464
WIRE 1072 -112 1072 -224
WIRE 1264 -672 1264 -800
WIRE 1264 -112 1264 -224
WIRE 688 -112 688 -224
WIRE 496 -112 496 -224
WIRE 880 -112 880 -224
WIRE 464 -448 496 -448
WIRE 656 -448 688 -448
WIRE 1424 224 1456 224
WIRE 1456 224 1456 112
WIRE 1424 608 1456 608
WIRE 1424 112 1456 112
WIRE 1424 -672 1456 -672
WIRE 1040 112 1072 112
WIRE 1456 -448 1456 -560
WIRE 1424 -448 1456 -448
WIRE 1456 -336 1456 -448
WIRE 432 -720 432 -800
WIRE 1424 -224 1456 -224
WIRE 1424 -560 1456 -560
WIRE 1424 -336 1456 -336
WIRE 1456 -672 1456 -800
WIRE 1424 -112 1456 -112
WIRE 1456 0 1456 -112
WIRE 1424 0 1456 0
WIRE 1456 -560 1456 -672
WIRE 1456 -800 1568 -800
WIRE 1072 -560 1072 -672
WIRE 656 -112 688 -112
WIRE 656 0 688 0
WIRE 1232 -112 1264 -112
WIRE 1072 -336 1072 -448
WIRE 624 -800 624 -1008
WIRE 1456 112 1456 0
WIRE 880 112 880 0
WIRE 1072 112 1072 0
WIRE 688 112 688 0
WIRE 496 112 496 0
WIRE 1264 112 1264 0
WIRE 1264 -800 1456 -800
WIRE 688 0 688 -112
WIRE 1456 -224 1456 -336
WIRE 1456 -112 1456 -224
WIRE 1232 -336 1264 -336
WIRE 1264 -336 1264 -448
WIRE 1616 -224 1616 -352
WIRE 1568 -464 1616 -464
WIRE 1600 -672 1616 -672
WIRE 1616 -672 1616 -736
WIRE 1600 -352 1616 -352
WIRE 1600 -544 1616 -544
WIRE 1568 -592 1568 -608
WIRE 624 -800 688 -800
WIRE 1616 -608 1616 -672
WIRE 1568 -736 1616 -736
WIRE 1568 -608 1616 -608
WIRE 1616 -544 1616 -608
WIRE 1568 -464 1568 -496
WIRE 1568 -608 1568 -624
WIRE 1616 -464 1616 -544
WIRE 1568 -720 1568 -736
WIRE 1760 -768 1760 -800
WIRE 1760 -800 1808 -800
WIRE 1600 -224 1616 -224
WIRE 1008 -48 1008 -64
WIRE 1328 752 1328 720
WIRE 1200 720 1264 720
WIRE 1264 752 1264 720
WIRE 1136 752 1136 720
WIRE 1136 720 1200 720
WIRE 1200 752 1200 720
WIRE 1264 720 1328 720
WIRE 1392 752 1392 720
WIRE 1392 720 1392 656
WIRE 1328 720 1392 720
WIRE 1200 64 1200 48
WIRE -1232 -32 -1232 -80
WIRE 432 -48 432 -64
WIRE 1392 -496 1392 -512
WIRE -1440 -816 -1440 -848
WIRE 432 -272 432 -288
WIRE -1440 -688 -1440 -720
WIRE -1232 -1200 -1232 -1232
WIRE 624 208 752 208
WIRE 624 208 624 160
WIRE 816 -720 816 -752
WIRE 752 -752 816 -752
WIRE 752 208 752 -752
WIRE 816 -384 816 -400
WIRE 80 -192 80 -912
WIRE 80 -912 368 -912
WIRE 80 -48 80 -192
WIRE 0 -192 80 -192
WIRE 80 -912 80 -1152
FLAG 3216 -704 IA1
IOPIN 3216 -704 inout
FLAG 3440 -704 IA2
IOPIN 3440 -704 inout
FLAG 2800 -1888 VCC
IOPIN 2800 -1888 inout
FLAG 1728 -2400 VBB
IOPIN 1728 -2400 inout
FLAG -1488 -1520 VREG
IOPIN -1488 -1520 inout
FLAG -1392 944 GND
IOPIN -1392 944 inout
FLAG 3664 -704 IA3
IOPIN 3664 -704 inout
FLAG 4576 576 IOFF
IOPIN 4576 576 inout
SYMBOL RR 1568 -720 R0
SYMATTR InstName R10
SYMATTR Value 12.01127K
SYMBOL RH 4352 -1008 R0
SYMATTR InstName R67
SYMATTR Value 124.9253K
SYMBOL MN -464 384 R0
SYMATTR InstName M3
SYMATTR Value2 m=2 l=2u w=8u
SYMBOL MP 2960 -976 M0
SYMATTR InstName M16
SYMATTR Value2 l=4.8u m=2 w=8u
SYMBOL RR 1568 -272 R0
SYMATTR InstName R8
SYMATTR Value 12.01127K
SYMBOL CSIO 3328 816 M180
SYMATTR InstName C1
SYMATTR Value 500fF
SYMBOL RR 432 -272 R0
SYMATTR InstName R97
SYMATTR Value 12.01127K
SYMBOL RR 1200 -160 R0
SYMATTR InstName R144
SYMATTR Value 12.01127K
SYMBOL MN 16 0 R0
SYMATTR InstName M48
SYMATTR Value2 l=2u w=24u m=4
SYMBOL RR 2896 -496 M0
SYMATTR InstName R59
SYMATTR Value 21.99133K
SYMBOL CSIO 3088 -1056 M180
SYMATTR InstName C6
SYMATTR Value 1p
SYMBOL RR 816 176 R0
SYMATTR InstName R20
SYMATTR Value 12.01127K
SYMBOL RR 1392 -496 R0
SYMATTR InstName R138
SYMATTR Value 12.01127K
SYMBOL MN 3776 784 M0
SYMATTR InstName M23
SYMATTR Value2 w=8u m=4 l=4.8u
SYMBOL MP -336 -784 M0
SYMATTR InstName M0
SYMATTR Value2 l=2u w=24u m=2
SYMBOL MN -592 384 M0
SYMATTR InstName M2
SYMATTR Value2 l=2u w=8u m=2
SYMBOL MN 4224 784 M0
SYMATTR InstName M28
SYMATTR Value2 w=8u l=1u
SYMBOL RH -1232 -688 R0
SYMATTR InstName R130
SYMATTR Value 100.0013K
SYMBOL DN 3024 720 R0
SYMATTR InstName D19
SYMBOL RH -1232 -1328 R0
SYMATTR InstName R135
SYMATTR Value 100.0013K
SYMBOL RR 432 -384 R0
SYMATTR InstName R56
SYMATTR Value 12.01127K
SYMBOL DP 1392 848 R0
SYMATTR InstName D16
SYMBOL CSIO 2256 -2032 M180
SYMATTR InstName C56
SYMATTR Value 5p
SYMBOL DP 896 848 R0
SYMATTR InstName D6
SYMBOL RH -1232 -176 R0
SYMATTR InstName R196
SYMATTR Value 100.0013K
SYMBOL RH -1440 80 R0
SYMATTR InstName R14
SYMATTR Value 100.0013K
SYMBOL RR 1392 -160 R0
SYMATTR InstName R141
SYMATTR Value 12.01127K
SYMBOL RR 432 -160 R0
SYMATTR InstName R57
SYMATTR Value 12.01127K
SYMBOL RR 624 -384 R0
SYMATTR InstName R35
SYMATTR Value 12.01127K
SYMBOL DN 2240 -768 R0
SYMATTR InstName D21
SYMBOL RH -1440 -688 R0
SYMATTR InstName R133
SYMATTR Value 100.0013K
SYMBOL MP 3600 -976 R0
SYMATTR InstName M17
SYMATTR Value2 m=2 w=8u l=4.8u
SYMBOL RR 2896 -240 M0
SYMATTR InstName R61
SYMATTR Value 21.99133K
SYMBOL RR 816 -720 R0
SYMATTR InstName R94
SYMATTR Value 12.01127K
SYMBOL RR 2512 144 R0
SYMATTR InstName R171
SYMATTR Value 21.99133K
SYMBOL RR 624 -496 R0
SYMATTR InstName R43
SYMATTR Value 12.01127K
SYMBOL RH -1232 -304 R0
SYMATTR InstName R192
SYMATTR Value 100.0013K
SYMBOL DP -784 -496 R0
SYMATTR InstName D0
SYMBOL RR 2896 144 M0
SYMATTR InstName R66
SYMATTR Value 21.99133K
SYMBOL MPO 1936 -2240 M0
SYMATTR InstName M12
SYMATTR Value2 l=4.8u w=6.8u m=2
SYMBOL MN 2160 640 R0
SYMATTR InstName M5
SYMATTR Value2 w=24u m=5 l=2u
SYMBOL MP -816 -1200 M0
SYMATTR InstName M63
SYMATTR Value2 l=4u w=24u
SYMBOL MP 3152 -976 R0
SYMATTR InstName M15
SYMATTR Value2 l=4.8u w=8u m=2
SYMBOL RR 1392 -272 R0
SYMATTR InstName R142
SYMATTR Value 12.01127K
SYMBOL RH -1440 -816 R0
SYMATTR InstName R124
SYMATTR Value 100.0013K
SYMBOL MP 4160 -1120 R0
SYMATTR InstName M20
SYMATTR Value2 m=4 w=8u l=4.8u
SYMBOL MN 4000 784 M0
SYMATTR InstName M27
SYMATTR Value2 w=8u l=2u
SYMBOL RH -1056 -1200 R0
SYMATTR InstName R12
SYMATTR Value 100.0013K
SYMBOL MP -720 -784 R0
SYMATTR InstName M1
SYMATTR Value2 w=24u l=2u m=2
SYMBOL RR -96 -192 R270
SYMATTR InstName R499
SYMATTR Value 7.996299K
SYMBOL RH -1056 -1328 R0
SYMATTR InstName R15
SYMATTR Value 100.0013K
SYMBOL MP 4160 -960 R0
SYMATTR InstName M21
SYMATTR Value2 l=1u m=7 w=8u
SYMBOL DP 4032 -1152 R0
SYMATTR InstName D23
SYMBOL RR 1392 176 R0
SYMATTR InstName R139
SYMATTR Value 12.01127K
SYMBOL RR 2896 -624 M0
SYMATTR InstName R113
SYMATTR Value 21.99133K
SYMBOL RR 432 64 R0
SYMATTR InstName R36
SYMATTR Value 12.01127K
SYMBOL RR 432 -48 R0
SYMATTR InstName R38
SYMATTR Value 12.01127K
SYMBOL RH -1232 -1072 R0
SYMATTR InstName R206
SYMATTR Value 100.0013K
SYMBOL MP 368 -912 R0
SYMATTR InstName M62
SYMATTR Value2 l=2u w=24u m=4
SYMBOL RH -1232 352 R0
SYMATTR InstName R18
SYMATTR Value 100.0013K
SYMBOL MP 560 -1056 R0
SYMATTR InstName M61
SYMATTR Value2 w=12u l=4u
SYMBOL MP -592 -1200 R0
SYMATTR InstName M60
SYMATTR Value2 w=24u l=4u m=2
SYMBOL RR 624 -720 R0
SYMATTR InstName R90
SYMATTR Value 12.01127K
SYMBOL RH -1232 -1200 R0
SYMATTR InstName R197
SYMATTR Value 100.0013K
SYMBOL RR 816 -48 R0
SYMATTR InstName R108
SYMATTR Value 12.01127K
SYMBOL RH -1232 224 R0
SYMATTR InstName R11
SYMATTR Value 100.0013K
SYMBOL RR 1392 64 R0
SYMATTR InstName R140
SYMATTR Value 12.01127K
SYMBOL MP 3376 -976 R0
SYMATTR InstName M13
SYMATTR Value2 l=4.8u w=8u m=2
SYMBOL RR 1392 -48 R0
SYMATTR InstName R143
SYMATTR Value 12.01127K
SYMBOL RR 2512 -112 R0
SYMATTR InstName R169
SYMATTR Value 21.99133K
SYMBOL RR 624 -48 R0
SYMATTR InstName R48
SYMATTR Value 12.01127K
SYMBOL MPO 2064 -2240 R0
SYMATTR InstName M19
SYMATTR Value2 w=6.8u m=2 l=4.8u
SYMBOL RR 1008 -272 R0
SYMATTR InstName R164
SYMATTR Value 12.01127K
SYMBOL RR 2512 272 R0
SYMATTR InstName R172
SYMATTR Value 21.99133K
SYMBOL RR 2512 -1328 R0
SYMATTR InstName R123
SYMATTR Value 21.99133K
SYMBOL MN 2192 -800 M0
SYMATTR InstName M42
SYMATTR Value2 l=10u m=2 w=20u
SYMBOL RR 1200 -720 R0
SYMATTR InstName R163
SYMATTR Value 12.01127K
SYMBOL RH -1440 -432 R0
SYMATTR InstName R131
SYMATTR Value 100.0013K
SYMBOL MP 864 -1312 R0
SYMATTR InstName M11
SYMATTR Value2 l=2u w=24u m=2
SYMBOL RH -1440 -560 R0
SYMATTR InstName R127
SYMATTR Value 100.0013K
SYMBOL CSIO -144 -48 M180
SYMATTR InstName C4
SYMATTR Value 1.5p
SYMBOL RR 1008 -384 R0
SYMATTR InstName R161
SYMATTR Value 12.01127K
SYMBOL DP 1024 848 R0
SYMATTR InstName D8
SYMBOL DP -272 -496 R0
SYMATTR InstName D1
SYMBOL MPO 2448 -2000 R0
SYMATTR InstName M6
SYMATTR Value2 w=20u m=40 l=3.5u
SYMBOL MN 1936 496 R0
SYMATTR InstName M49
SYMATTR Value2 w=24u m=6 l=2u
SYMBOL RR 816 -608 R0
SYMATTR InstName R62
SYMATTR Value 12.01127K
SYMBOL MP 4464 432 M0
SYMATTR InstName M14
SYMATTR Value2 m=2 w=8u l=1u
SYMBOL RR 816 64 R0
SYMATTR InstName R46
SYMATTR Value 12.01127K
SYMBOL RR 1200 64 R0
SYMATTR InstName R145
SYMATTR Value 12.01127K
SYMBOL RR 624 64 R0
SYMATTR InstName R22
SYMATTR Value 12.01127K
SYMBOL RR 2512 -1456 R0
SYMATTR InstName R122
SYMATTR Value 21.99133K
SYMBOL RH -1440 -1328 R0
SYMATTR InstName R128
SYMATTR Value 100.0013K
SYMBOL RR 2896 -752 M0
SYMATTR InstName R54
SYMATTR Value 21.99133K
SYMBOL CSIO 2384 -2032 M180
SYMATTR InstName C58
SYMATTR Value 5p
SYMBOL MP -336 -368 M0
SYMATTR InstName M65
SYMATTR Value2 w=24u m=4 l=8u
SYMBOL MP -720 -368 R0
SYMATTR InstName M64
SYMATTR Value2 m=4 w=24u l=8u
SYMBOL DP 4496 272 M0
SYMATTR InstName D11
SYMBOL RR 2512 -944 R0
SYMATTR InstName R74
SYMATTR Value 21.99133K
SYMBOL RR 624 -608 R0
SYMATTR InstName R51
SYMATTR Value 12.01127K
SYMBOL RH 2384 -2352 R0
SYMATTR InstName R42
SYMATTR Value 10.02683K
SYMBOL DP 1136 848 R0
SYMATTR InstName D14
SYMBOL RR 2672 -1712 R0
SYMATTR InstName R70
SYMATTR Value 21.99133K
SYMBOL MP 16 -1200 R0
SYMATTR InstName M66
SYMATTR Value2 l=4u m=6 w=24u
SYMBOL RR 1200 -496 R0
SYMATTR InstName R150
SYMATTR Value 12.01127K
SYMBOL RR 1008 64 R0
SYMATTR InstName R148
SYMATTR Value 12.01127K
SYMBOL RR 2512 -1584 R0
SYMATTR InstName R121
SYMATTR Value 21.99133K
SYMBOL MNO 1936 -1280 M0
SYMATTR InstName M25
SYMATTR Value2 l=6u w=6u
SYMBOL RR 2512 -752 R0
SYMATTR InstName R73
SYMATTR Value 21.99133K
SYMBOL RH 2256 -2352 R0
SYMATTR InstName R40
SYMATTR Value 10.02683K
SYMBOL DP 1264 848 R0
SYMATTR InstName D15
SYMBOL RR 1200 -48 R0
SYMATTR InstName R152
SYMATTR Value 12.01127K
SYMBOL RR 1008 -160 R0
SYMATTR InstName R162
SYMATTR Value 12.01127K
SYMBOL MN -1040 816 M0
SYMATTR InstName M9
SYMATTR Value2 m=2 w=24u l=2u
SYMBOL MP 240 -1312 R0
SYMATTR InstName M4
SYMATTR Value2 m=4 w=24u l=4u
SYMBOL RR 2512 -240 R0
SYMATTR InstName R168
SYMATTR Value 21.99133K
SYMBOL RH -1440 -304 R0
SYMATTR InstName R160
SYMATTR Value 100.0013K
SYMBOL RR 1200 -272 R0
SYMATTR InstName R151
SYMATTR Value 12.01127K
SYMBOL RR 1392 560 R0
SYMATTR InstName R64
SYMATTR Value 12.01127K
SYMBOL DN 1760 -768 R0
SYMATTR InstName D20
SYMBOL MN -464 112 R0
SYMATTR InstName M51
SYMATTR Value2 w=8u l=24u m=2
SYMBOL MN 4464 704 M0
SYMATTR InstName M18
SYMATTR Value2 w=8u l=1u
SYMBOL DN 3168 720 R0
SYMATTR InstName D26
SYMBOL RH -1232 96 R0
SYMATTR InstName R17
SYMATTR Value 100.0013K
SYMBOL MNO 2064 -1280 R0
SYMATTR InstName M26
SYMATTR Value2 w=6u l=6u
SYMBOL RH 4160 576 R270
SYMATTR InstName R45
SYMATTR Value 124.9253K
SYMBOL DP 960 848 R0
SYMATTR InstName D7
SYMBOL DP 3952 -1152 R0
SYMATTR InstName D22
SYMBOL RR 624 -272 R0
SYMATTR InstName R47
SYMATTR Value 12.01127K
SYMBOL MN -944 640 R0
SYMATTR InstName M47
SYMATTR Value2 m=2 w=24u l=2u
SYMBOL RH -1232 -944 R0
SYMATTR InstName R191
SYMATTR Value 100.0013K
SYMBOL RR 1392 -384 R0
SYMATTR InstName R137
SYMATTR Value 12.01127K
SYMBOL DP 1328 848 R0
SYMATTR InstName D17
SYMBOL RH -1440 -1200 R0
SYMATTR InstName R193
SYMATTR Value 100.0013K
SYMBOL RR 2512 -1200 R0
SYMATTR InstName R132
SYMATTR Value 21.99133K
SYMBOL RR 1008 -608 R0
SYMATTR InstName R154
SYMATTR Value 12.01127K
SYMBOL MP 3920 -976 M0
SYMATTR InstName M29
SYMATTR Value2 l=1u w=8u
SYMBOL RR 816 -272 R0
SYMATTR InstName R96
SYMATTR Value 12.01127K
SYMBOL RR 816 -384 R0
SYMATTR InstName R39
SYMATTR Value 12.01127K
SYMBOL DN 4496 768 M0
SYMATTR InstName D13
SYMBOL RR 2512 16 R0
SYMATTR InstName R170
SYMATTR Value 21.99133K
SYMBOL RR -192 -432 R270
SYMATTR InstName R1
SYMATTR Value 7.996299K
SYMBOL RR 2672 -1584 R0
SYMATTR InstName R71
SYMATTR Value 21.99133K
SYMBOL RH -1440 -944 R0
SYMATTR InstName R159
SYMATTR Value 100.0013K
SYMBOL RR 2896 -112 M0
SYMATTR InstName R63
SYMATTR Value 21.99133K
SYMBOL RH -1440 -176 R0
SYMATTR InstName R125
SYMATTR Value 100.0013K
SYMBOL RH 4352 -1168 R0
SYMATTR InstName R72
SYMATTR Value 124.9253K
SYMBOL MN 1808 -800 R0
SYMATTR InstName M52
SYMATTR Value2 m=2 l=10u w=20u
SYMBOL RH -1440 -48 R0
SYMATTR InstName R13
SYMATTR Value 100.0013K
SYMBOL RH -1232 -32 R0
SYMATTR InstName R16
SYMATTR Value 100.0013K
SYMBOL MN 240 816 R0
SYMATTR InstName M10
SYMATTR Value2 l=2u w=24u m=5
SYMBOL RH 4016 576 R270
SYMATTR InstName R50
SYMATTR Value 124.9253K
SYMBOL RR 1568 -400 R0
SYMATTR InstName R9
SYMATTR Value 12.01127K
SYMBOL CSIO -208 -48 M180
SYMATTR InstName C0
SYMATTR Value 1.5p
SYMBOL MN 2736 576 M0
SYMATTR InstName M22
SYMATTR Value2 w=8u m=2 l=1u
SYMBOL RR 624 -160 R0
SYMATTR InstName R19
SYMATTR Value 12.01127K
SYMBOL DN -256 752 R0
SYMATTR InstName D10
SYMBOL RR 2512 -496 R0
SYMATTR InstName R166
SYMATTR Value 21.99133K
SYMBOL DP 1200 848 R0
SYMATTR InstName D18
SYMBOL RH -1232 -560 R0
SYMATTR InstName R129
SYMATTR Value 100.0013K
SYMBOL RR 1392 -720 R0
SYMATTR InstName R126
SYMATTR Value 12.01127K
SYMBOL RR 2512 -368 R0
SYMATTR InstName R167
SYMATTR Value 21.99133K
SYMBOL RR 2512 -624 R0
SYMATTR InstName R165
SYMATTR Value 21.99133K
SYMBOL MN -592 112 M0
SYMATTR InstName M50
SYMATTR Value2 l=24u w=8u m=2
SYMBOL DN -80 192 R0
SYMATTR InstName D4
SYMBOL RH -1232 -816 R0
SYMATTR InstName R155
SYMATTR Value 100.0013K
SYMBOL RR 432 -608 R0
SYMATTR InstName R53
SYMATTR Value 12.01127K
SYMBOL RR 1200 -608 R0
SYMATTR InstName R153
SYMATTR Value 12.01127K
SYMBOL RH -1440 336 R0
SYMATTR InstName R195
SYMATTR Value 100.0013K
SYMBOL RR 816 -496 R0
SYMATTR InstName R58
SYMATTR Value 12.01127K
SYMBOL RH -1440 -1072 R0
SYMATTR InstName R134
SYMATTR Value 100.0013K
SYMBOL MN 2192 -448 M0
SYMATTR InstName M7
SYMATTR Value2 m=2 l=2u w=20u
SYMBOL RR 1008 -496 R0
SYMATTR InstName R146
SYMATTR Value 12.01127K
SYMBOL RR 816 -160 R0
SYMATTR InstName R95
SYMATTR Value 12.01127K
SYMBOL RR 1200 -384 R0
SYMATTR InstName R147
SYMATTR Value 12.01127K
SYMBOL RR 2512 -1712 R0
SYMATTR InstName R391
SYMATTR Value 21.99133K
SYMBOL RR 1392 -608 R0
SYMATTR InstName R136
SYMATTR Value 12.01127K
SYMBOL RR 432 -720 R0
SYMATTR InstName R55
SYMATTR Value 12.01127K
SYMBOL RR 2896 -368 M0
SYMATTR InstName R60
SYMATTR Value 21.99133K
SYMBOL RR 432 -496 R0
SYMATTR InstName R23
SYMATTR Value 12.01127K
SYMBOL RR 1568 -592 R0
SYMATTR InstName R7
SYMATTR Value 12.01127K
SYMBOL MN 1808 -448 R0
SYMATTR InstName M8
SYMATTR Value2 m=2 w=20u l=2u
SYMBOL RR 1008 -48 R0
SYMATTR InstName R149
SYMATTR Value 12.01127K
SYMBOL RR -192 -288 R270
SYMATTR InstName R0
SYMATTR Value 7.996299K
SYMBOL MN 2960 576 M0
SYMATTR InstName M24
SYMATTR Value2 w=8u m=2 l=1u
SYMBOL MN -1168 640 M0
SYMATTR InstName M46
SYMATTR Value2 l=2u w=24u
SYMBOL DP 816 848 R0
SYMATTR InstName D9
SYMBOL RR 2896 16 M0
SYMATTR InstName R65
SYMATTR Value 21.99133K
SYMBOL RH -1232 -432 R0
SYMATTR InstName R194
SYMATTR Value 100.0013K
SYMBOL RR 2512 -1072 R0
SYMATTR InstName R156
SYMATTR Value 21.99133K
SYMBOL RR 1008 -720 R0
SYMATTR InstName R157
SYMATTR Value 12.01127K
SYMBOL RH -1440 208 R0
SYMATTR InstName R158
SYMATTR Value 100.0013K

The netlist it stands for:
* &400_VREG_00.asc
XR10 N106 N106 N106 12.01127K  ; pins PLUS MINUS SUB
XR67 VCC VCC VCC 124.9253K  ; pins PLUS MINUS SUB
M3 GND GND GND GND MN m=2 l=2u w=8u
M16 VCC N017 N017 VCC MP l=4.8u m=2 w=8u
XR8 N065 N065 N106 12.01127K  ; pins PLUS MINUS SUB
C1 GND GND 500fF
XR97 N114 N085 N106 12.01127K  ; pins PLUS MINUS SUB
XR144 N020 N004 N106 12.01127K  ; pins PLUS MINUS SUB
M48 GND N041 N119 GND MN l=2u w=24u m=4
XR59 N095 N079 VCC 21.99133K  ; pins PLUS MINUS SUB
C6 N017 VCC 1p
XR20 N076 N040 N106 12.01127K  ; pins PLUS MINUS SUB
XR138 N112 N100 N106 12.01127K  ; pins PLUS MINUS SUB
M23 GND GND GND GND MN w=8u m=4 l=4.8u
M0 N074 N074 N074 VREG MP l=2u w=24u m=2
M2 GND GND GND GND MN l=2u w=8u m=2
M28 GND GND GND GND MN w=8u l=1u
XR130 N064 N050 VREG 100.0013K  ; pins PLUS MINUS SUB
D19 GND N068 DN
XR135 N054 N116 VREG 100.0013K  ; pins PLUS MINUS SUB
XR56 N090 N114 N106 12.01127K  ; pins PLUS MINUS SUB
D16 GND GND DP
C56 N018 N080 5p
D6 GND GND DP
XR196 N013 N110 VREG 100.0013K  ; pins PLUS MINUS SUB
XR14 N072 N070 VREG 100.0013K  ; pins PLUS MINUS SUB
XR141 N028 N060 N106 12.01127K  ; pins PLUS MINUS SUB
XR57 N085 N111 N106 12.01127K  ; pins PLUS MINUS SUB
XR35 N047 N051 N106 12.01127K  ; pins PLUS MINUS SUB
D21 GND N081 DN
XR133 N115 N002 VREG 100.0013K  ; pins PLUS MINUS SUB
M17 VCC N017 IA3 VCC MP m=2 w=8u l=4.8u
XR61 N077 N007 VCC 21.99133K  ; pins PLUS MINUS SUB
XR94 N117 N067 N106 12.01127K  ; pins PLUS MINUS SUB
XR171 N027 N071 VCC 21.99133K  ; pins PLUS MINUS SUB
XR43 N032 N047 N106 12.01127K  ; pins PLUS MINUS SUB
XR192 N011 N013 VREG 100.0013K  ; pins PLUS MINUS SUB
D0 N040 VREG DP
XR66 N096 N087 VCC 21.99133K  ; pins PLUS MINUS SUB
M12 VBB N073 N018 VBB MPO l=4.8u w=6.8u m=2
M5 GND GND GND GND MN w=24u m=5 l=2u
M63 VREG N105 N105 VREG MP l=4u w=24u
M15 VCC N017 IA1 VCC MP l=4.8u w=8u m=2
XR142 N042 N028 N106 12.01127K  ; pins PLUS MINUS SUB
XR124 N113 N115 VREG 100.0013K  ; pins PLUS MINUS SUB
M20 VCC VCC VCC VCC MP m=4 w=8u l=4.8u
M27 GND GND GND GND MN w=8u l=2u
XR12 VREG VREG VREG 100.0013K  ; pins PLUS MINUS SUB
M1 N074 N074 N074 VREG MP w=24u l=2u m=2
XR499 N012 N119 VREG 7.996299K  ; pins PLUS MINUS SUB
XR15 VREG VREG VREG 100.0013K  ; pins PLUS MINUS SUB
M21 VCC VCC VCC VCC MP l=1u m=7 w=8u
D23 VCC VCC DP
XR139 N055 N065 N106 12.01127K  ; pins PLUS MINUS SUB
XR113 N075 N095 VCC 21.99133K  ; pins PLUS MINUS SUB
XR36 N026 N052 N106 12.01127K  ; pins PLUS MINUS SUB
XR38 N111 N026 N106 12.01127K  ; pins PLUS MINUS SUB
XR206 N103 N030 VREG 100.0013K  ; pins PLUS MINUS SUB
M62 VREG N119 N106 VREG MP l=2u w=24u m=4
XR18 N022 N034 VREG 100.0013K  ; pins PLUS MINUS SUB
M61 VREG N105 N106 VREG MP w=12u l=4u
M60 VREG N105 N074 VREG MP w=24u l=4u m=2
XR90 N052 N084 N106 12.01127K  ; pins PLUS MINUS SUB
XR197 N116 N103 VREG 100.0013K  ; pins PLUS MINUS SUB
XR108 N091 N016 N106 12.01127K  ; pins PLUS MINUS SUB
XR11 N037 N022 VREG 100.0013K  ; pins PLUS MINUS SUB
XR140 N010 N055 N106 12.01127K  ; pins PLUS MINUS SUB
M13 VCC N017 IA2 VCC MP l=4.8u w=8u m=2
XR143 N060 N010 N106 12.01127K  ; pins PLUS MINUS SUB
XR169 N097 N043 VCC 21.99133K  ; pins PLUS MINUS SUB
XR48 N102 N101 N106 12.01127K  ; pins PLUS MINUS SUB
M19 VBB N073 N073 VBB MPO w=6.8u m=2 l=4.8u
XR164 N057 N061 N106 12.01127K  ; pins PLUS MINUS SUB
XR172 N071 GND VCC 21.99133K  ; pins PLUS MINUS SUB
XR123 N029 N038 VCC 21.99133K  ; pins PLUS MINUS SUB
M42 N008 N081 N024 GND MN l=10u m=2 w=20u
XR163 N063 N066 N106 12.01127K  ; pins PLUS MINUS SUB
XR131 N019 N099 VREG 100.0013K  ; pins PLUS MINUS SUB
M11 VREG VREG VREG VREG MP l=2u w=24u m=2
XR127 N002 N019 VREG 100.0013K  ; pins PLUS MINUS SUB
C4 N041 N012 1.5p
XR161 N049 N057 N106 12.01127K  ; pins PLUS MINUS SUB
D8 GND GND DP
D1 N065 VREG DP
M6 VBB N018 VCC VBB MPO w=20u m=40 l=3.5u
M49 GND N034 N008 GND MN w=24u m=6 l=2u
XR62 N067 N053 N106 12.01127K  ; pins PLUS MINUS SUB
M14 VCC IOFF N025 VCC MP m=2 w=8u l=1u
XR46 N016 N076 N106 12.01127K  ; pins PLUS MINUS SUB
XR145 N109 N094 N106 12.01127K  ; pins PLUS MINUS SUB
XR22 N101 N117 N106 12.01127K  ; pins PLUS MINUS SUB
XR122 N098 N029 VCC 21.99133K  ; pins PLUS MINUS SUB
XR128 VREG N021 VREG 100.0013K  ; pins PLUS MINUS SUB
XR54 N017 N075 VCC 21.99133K  ; pins PLUS MINUS SUB
C58 N018 N080 5p
M65 N074 N065 N041 VREG MP w=24u m=4 l=8u
M64 N074 N040 N104 VREG MP m=4 w=24u l=8u
D11 IOFF VCC DP
XR74 N056 N081 VCC 21.99133K  ; pins PLUS MINUS SUB
XR51 N084 N032 N106 12.01127K  ; pins PLUS MINUS SUB
XR42 VBB N080 VBB 10.02683K  ; pins PLUS MINUS SUB
D14 GND GND DP
XR70 VCC VCC VCC 21.99133K  ; pins PLUS MINUS SUB
M66 VREG N105 N119 VREG MP l=4u m=6 w=24u
XR150 N015 N062 N106 12.01127K  ; pins PLUS MINUS SUB
XR148 N046 N063 N106 12.01127K  ; pins PLUS MINUS SUB
XR121 N089 N098 VCC 21.99133K  ; pins PLUS MINUS SUB
M25 N018 VREG N023 GND MNO l=6u w=6u
XR73 N081 N035 VCC 21.99133K  ; pins PLUS MINUS SUB
XR40 VBB N080 VBB 10.02683K  ; pins PLUS MINUS SUB
D15 GND GND DP
XR152 N004 N109 N106 12.01127K  ; pins PLUS MINUS SUB
XR162 N061 N107 N106 12.01127K  ; pins PLUS MINUS SUB
M9 GND GND GND GND MN m=2 w=24u l=2u
M4 VREG VREG VREG VREG MP m=4 w=24u l=4u
XR168 N086 N097 VCC 21.99133K  ; pins PLUS MINUS SUB
XR160 N099 N039 VREG 100.0013K  ; pins PLUS MINUS SUB
XR151 N033 N020 N106 12.01127K  ; pins PLUS MINUS SUB
XR64 N065 N108 N106 12.01127K  ; pins PLUS MINUS SUB
D20 GND N106 DN
M51 GND N104 N041 GND MN w=8u l=24u m=2
M18 GND IOFF N025 GND MN w=8u l=1u
D26 GND GND DN
XR17 N059 N037 VREG 100.0013K  ; pins PLUS MINUS SUB
M26 N073 VREG N024 GND MNO w=6u l=6u
XR45 N093 N025 VCC 124.9253K  ; pins PLUS MINUS SUB
D7 GND GND DP
D22 N068 VCC DP
XR47 N051 N009 N106 12.01127K  ; pins PLUS MINUS SUB
M47 GND N034 N105 GND MN m=2 w=24u l=2u
XR191 N030 N082 VREG 100.0013K  ; pins PLUS MINUS SUB
XR137 N100 N042 N106 12.01127K  ; pins PLUS MINUS SUB
D17 GND GND DP
XR193 N021 N031 VREG 100.0013K  ; pins PLUS MINUS SUB
XR132 N038 N036 VCC 21.99133K  ; pins PLUS MINUS SUB
XR154 N092 N001 N106 12.01127K  ; pins PLUS MINUS SUB
M29 VCC N068 N017 VCC MP l=1u w=8u
XR96 N048 N058 N106 12.01127K  ; pins PLUS MINUS SUB
XR39 N118 N048 N106 12.01127K  ; pins PLUS MINUS SUB
D13 GND IOFF DN
XR170 N043 N027 VCC 21.99133K  ; pins PLUS MINUS SUB
XR1 VREG VREG VREG 7.996299K  ; pins PLUS MINUS SUB
XR71 VCC VCC VCC 21.99133K  ; pins PLUS MINUS SUB
XR159 N083 N113 VREG 100.0013K  ; pins PLUS MINUS SUB
XR63 N007 N078 VCC 21.99133K  ; pins PLUS MINUS SUB
XR125 N039 N003 VREG 100.0013K  ; pins PLUS MINUS SUB
XR72 VCC VCC VCC 124.9253K  ; pins PLUS MINUS SUB
M52 N008 N106 N023 GND MN m=2 l=10u w=20u
XR13 N003 N072 VREG 100.0013K  ; pins PLUS MINUS SUB
XR16 N110 N059 VREG 100.0013K  ; pins PLUS MINUS SUB
M10 GND GND GND GND MN l=2u w=24u m=5
XR50 N068 N093 VCC 124.9253K  ; pins PLUS MINUS SUB
XR9 N065 N065 N106 12.01127K  ; pins PLUS MINUS SUB
C0 N041 N012 1.5p
M22 GND GND GND GND MN w=8u m=2 l=1u
XR19 N009 N102 N106 12.01127K  ; pins PLUS MINUS SUB
D10 GND GND DN
XR166 N088 N005 VCC 21.99133K  ; pins PLUS MINUS SUB
D18 GND GND DP
XR129 N050 N044 VREG 100.0013K  ; pins PLUS MINUS SUB
XR126 N094 N014 N106 12.01127K  ; pins PLUS MINUS SUB
XR167 N005 N086 VCC 21.99133K  ; pins PLUS MINUS SUB
XR165 N035 N088 VCC 21.99133K  ; pins PLUS MINUS SUB
M50 GND N104 N104 GND MN l=24u w=8u m=2
D4 GND N041 DN
XR155 N082 N064 VREG 100.0013K  ; pins PLUS MINUS SUB
XR53 N045 N006 N106 12.01127K  ; pins PLUS MINUS SUB
XR153 N066 N015 N106 12.01127K  ; pins PLUS MINUS SUB
XR195 N069 N054 VREG 100.0013K  ; pins PLUS MINUS SUB
XR58 N053 N118 N106 12.01127K  ; pins PLUS MINUS SUB
XR134 N031 N083 VREG 100.0013K  ; pins PLUS MINUS SUB
M7 N008 N008 N008 GND MN m=2 l=2u w=20u
XR146 N001 N049 N106 12.01127K  ; pins PLUS MINUS SUB
XR95 N058 N091 N106 12.01127K  ; pins PLUS MINUS SUB
XR147 N062 N033 N106 12.01127K  ; pins PLUS MINUS SUB
XR391 VCC N089 VCC 21.99133K  ; pins PLUS MINUS SUB
XR136 N014 N112 N106 12.01127K  ; pins PLUS MINUS SUB
XR55 N106 N045 N106 12.01127K  ; pins PLUS MINUS SUB
XR60 N079 N077 VCC 21.99133K  ; pins PLUS MINUS SUB
XR23 N006 N090 N106 12.01127K  ; pins PLUS MINUS SUB
XR7 N106 N106 N106 12.01127K  ; pins PLUS MINUS SUB
M8 N008 N008 N008 GND MN m=2 w=20u l=2u
XR149 N107 N046 N106 12.01127K  ; pins PLUS MINUS SUB
XR0 VREG VREG VREG 7.996299K  ; pins PLUS MINUS SUB
M24 GND N068 N087 GND MN w=8u m=2 l=1u
M46 GND N034 N034 GND MN l=2u w=24u
D9 GND GND DP
XR65 N078 N096 VCC 21.99133K  ; pins PLUS MINUS SUB
XR194 N044 N011 VREG 100.0013K  ; pins PLUS MINUS SUB
XR156 N036 N056 VCC 21.99133K  ; pins PLUS MINUS SUB
XR157 N106 N092 N106 12.01127K  ; pins PLUS MINUS SUB
XR158 N070 N069 VREG 100.0013K  ; pins PLUS MINUS SUB
.model D D
.lib standard.dio
.model NMOS NMOS
.model PMOS PMOS
.lib standard.mos
.backanno
.end